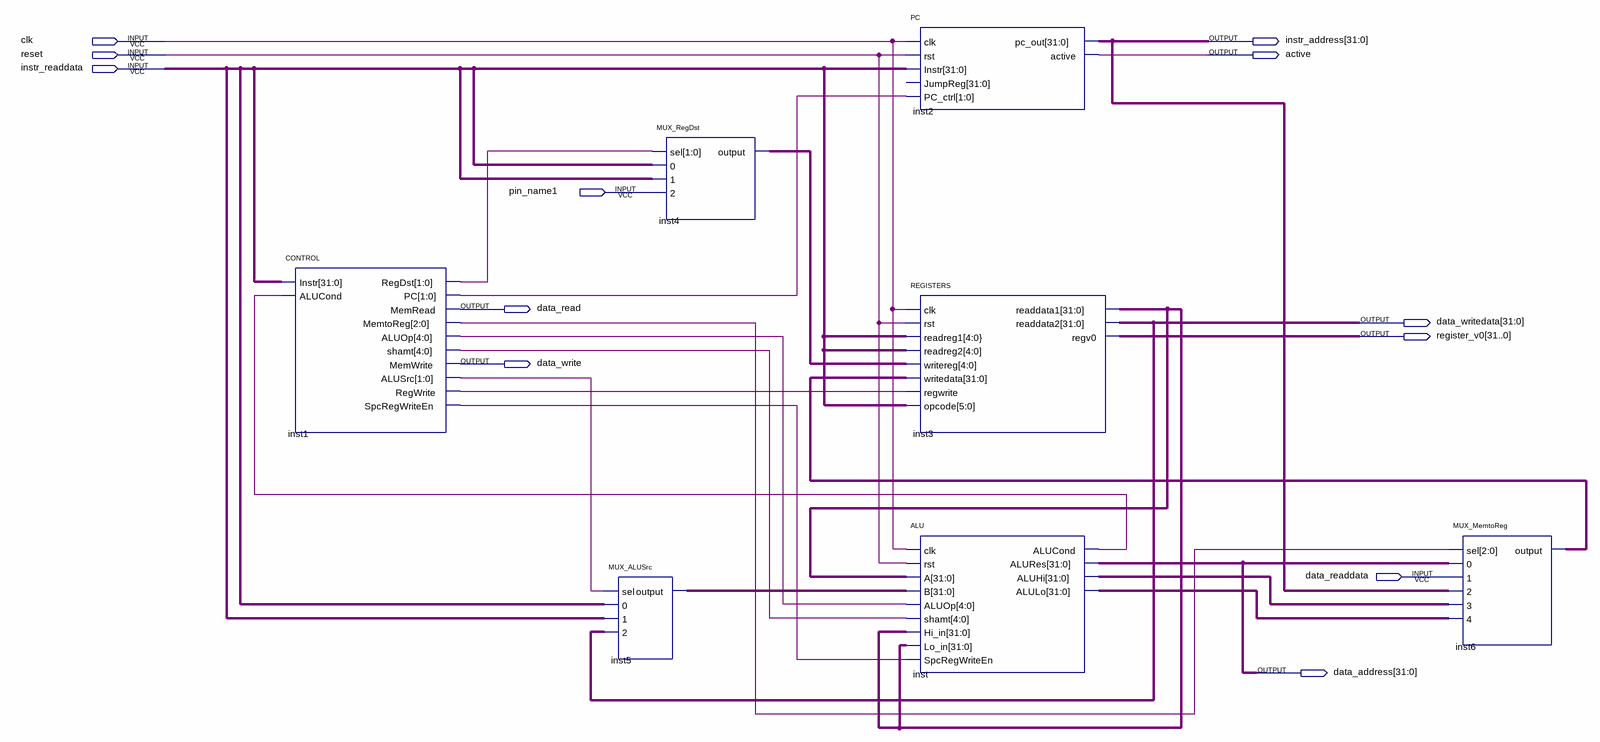
[diagram p0: schematic sheet]
// Quartus schematic MIPS_CPU_Diagram.bdf as structural Verilog: 7 symbols, 12 pins
module MIPS_CPU_Diagram (
  input  clk,
  input  reset,
  input  instr_readdata,
  input  pin_name1,
  input  data_readdata,
  output [31:0] instr_address,
  output active,
  output data_read,
  output [31:0] data_writedata,
  output [31:0] register_v0,
  output data_write,
  output [31:0] data_address
);

  wire inst1_alusrc, inst1_regwrite, inst1_spcregwriteen, inst_alucond;
  wire [1:0] inst1_pc, inst1_regdst;
  wire [2:0] inst1_memtoreg;
  wire [4:0] inst1_aluop, inst1_shamt, inst4_output;
  wire [31:0] inst3_readdata1, inst5_output, inst6_output, inst_aluhi, inst_alulo, undriven;

  CONTROL inst1 (
    .Instr(undriven), .ALUCond(inst_alucond), .RegDst(inst1_regdst), .PC(inst1_pc), .MemRead(data_read),
    .MemtoReg(inst1_memtoreg), .ALUOp(inst1_aluop), .shamt(inst1_shamt), .MemWrite(data_write),
    .ALUSrc(inst1_alusrc), .RegWrite(inst1_regwrite), .SpcRegWriteEn(inst1_spcregwriteen));
  MUX_ALUSrc inst5 (.sel(inst1_alusrc), .\0 (undriven), .\1 (undriven), .\2 (data_writedata), .\output (inst5_output));
  MUX_RegDst inst4 (.sel(inst1_regdst), .\0 (undriven), .\1 (undriven), .\2 (pin_name1), .\output (inst4_output));
  PC inst2 (
    .clk(clk), .rst(reset), .Instr(undriven), .PC_ctrl(inst1_pc), .pc_out(instr_address), .active(active));  // open: JumpReg
  REGISTERS inst3 (
    .clk(clk), .rst(reset), .\readreg1[4:0} (undriven), .readreg2(undriven), .writereg(inst4_output),
    .writedata(inst6_output), .regwrite(inst1_regwrite), .opcode(undriven), .readdata1(inst3_readdata1),
    .readdata2(data_writedata), .regv0(register_v0));
  ALU inst (
    .clk(clk), .rst(reset), .A(inst3_readdata1), .B(inst5_output), .ALUOp(inst1_aluop), .shamt(inst1_shamt),
    .Hi_in(inst3_readdata1), .Lo_in(inst3_readdata1), .SpcRegWriteEn(inst1_spcregwriteen),
    .ALUCond(inst_alucond), .ALURes(data_address), .ALUHi(inst_aluhi), .ALULo(inst_alulo));
  MUX_MemtoReg inst6 (
    .sel(inst1_memtoreg), .\0 (data_address), .\1 (data_readdata), .\2 (instr_address), .\3 (inst_aluhi),
    .\4 (inst_alulo), .\output (inst6_output));
endmodule
